# Altium schematic sheet MPU6050.SchDoc
size A; SheetNumber: 4; SheetTotal: 9
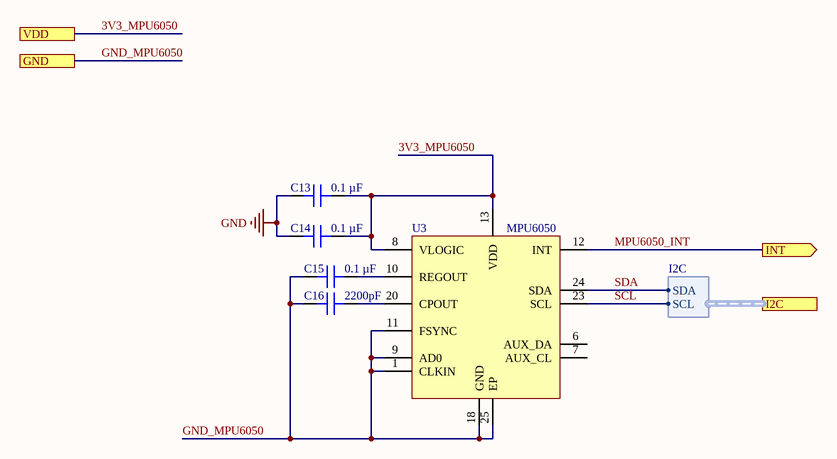
[diagram p0: MPU6050.SchDoc]

## Parts
C13  0.1 µF  [CAP 0402_1005]
C14  0.1 µF  [CAP 0402_1005]
C15  0.1 µF  [CAP 0402_1005]
C16  2200pF  [CAP 0603_1608]
U3  MPU6050  [IC_MPU6050]

## Ports
GND, I2C (harness I2C), INT (out), VDD

## Harnesses
I2C: SCL, SDA

## Nets
GND: C13.2 C14.2
3V3_MPU6050: C13.1 C14.1 U3.8(VLOGIC) U3.13(VDD) ; port VDD
GND_MPU6050: C15.2 C16.2 U3.1(CLKIN) U3.9(AD0) U3.11(FSYNC) U3.18(GND) U3.25(EP) ; port GND
MPU6050_INT: U3.12(INT) ; port INT
SCL: U3.23(SCL) ; port I2C.SCL
SDA: U3.24(SDA) ; port I2C.SDA
NetC15_1: C15.1 U3.10(REGOUT)
NetC16_1: C16.1 U3.20(CPOUT)

Not connected (* = marked no-connect by the designer): U3 6(AUX_DA) 7(AUX_CL)

## Library data of the parts
C13-C15 = C0402C104K4RACAUTO: CAP CER 0.1UF 16V X7R 0402; manufacturer: KEMET; Tolerance: ±10%; Part Number: C0402C104K4RACAUTO; Value: 0.1 µF; Applications: Automotive, Bypass, Decoupling; Capacitance: 0.1 µF; componentlink1description: Datasheet; componentlink1url: https://api.kemet.com/component-edge/download/specsheet/C0402C104K4RACAUTO.pdf; componentlink2description: DigiKey Link; componentlink2url: https://www.digikey.com/en/products/detail/kemet/C0402C104K4RACAUTO/3314827; Device Package: 0402 (1005 Metric); lastupdated: 8/14/2022 9:05:51 PM; Lifecycle Status: Active; Minimum Order: 1; Mounting Type: Surface Mount, MLCC; Operating Temperature: -55°C ~ 125°C; Package / Case: 0402 (1005 Metric); packaging: TapeAndReel; partid: 3024; Part Status: Active; price: 0.01; Ratings: AEC-Q200; series: SMD Auto X7R; Size / Dimension: 0.039" L x 0.020" W (1.00mm x 0.50mm); Supplier 1: DigiKey; Supplier Part Number 1: 399-6828-1-ND; Temperature Coefficient: X7R; Thickness (Max): 0.022" (0.55mm); Voltage - Rated: 16V
C16 = CGA3E2X8R1H222M080AD: CAP CER 2200PF 50V 0603 EPOXY; Manufacturer: TDK Corporation; Temperature Coefficient: X8R; Tolerance: ±20%; Part Number: CGA3E2X8R1H222M080AD; Value: 2200pF; Applications: Automotive; Capacitance: 2200pF; ComponentLink1Description: Datasheet; ComponentLink1URL: https://product.tdk.com/info/en/catalog/datasheets/mlcc_automotive_epoxy_en.pdf?ref_disty=digikey; ComponentLink2Description: DigiKey Link; ComponentLink2URL: http://digikey.com/product-detail/en/tdk-corporation/CGA3E2X8R1H222M080AD/445-9890-1-ND/3931817; Device Package: 0603 (1608 Metric); Features: Epoxy Mountable; LastUpdated: 13-Aug-20 10:19:25 AM; Lifecycle Status: Active; Minimum Order: 1; Mounting Type: Surface Mount, MLCC, Epoxy; Operating Temperature: -55°C ~ 150°C; Package / Case: 0603 (1608 Metric); Packaging: TapeAndReel; PartId: 17643; Part Status: Active; Price: 0.05; Ratings: AEC-Q200; Series: CGA; Size / Dimension: 0.063" L x 0.031" W (1.60mm x 0.80mm); Supplier 1: DigiKey; Supplier Part Number 1: 445-9890-1-ND; Thickness (Max): 0.031" (0.80mm)